# Altium schematic sheet schematic.SchDoc
size A; SheetNumber: 1; SheetTotal: 1
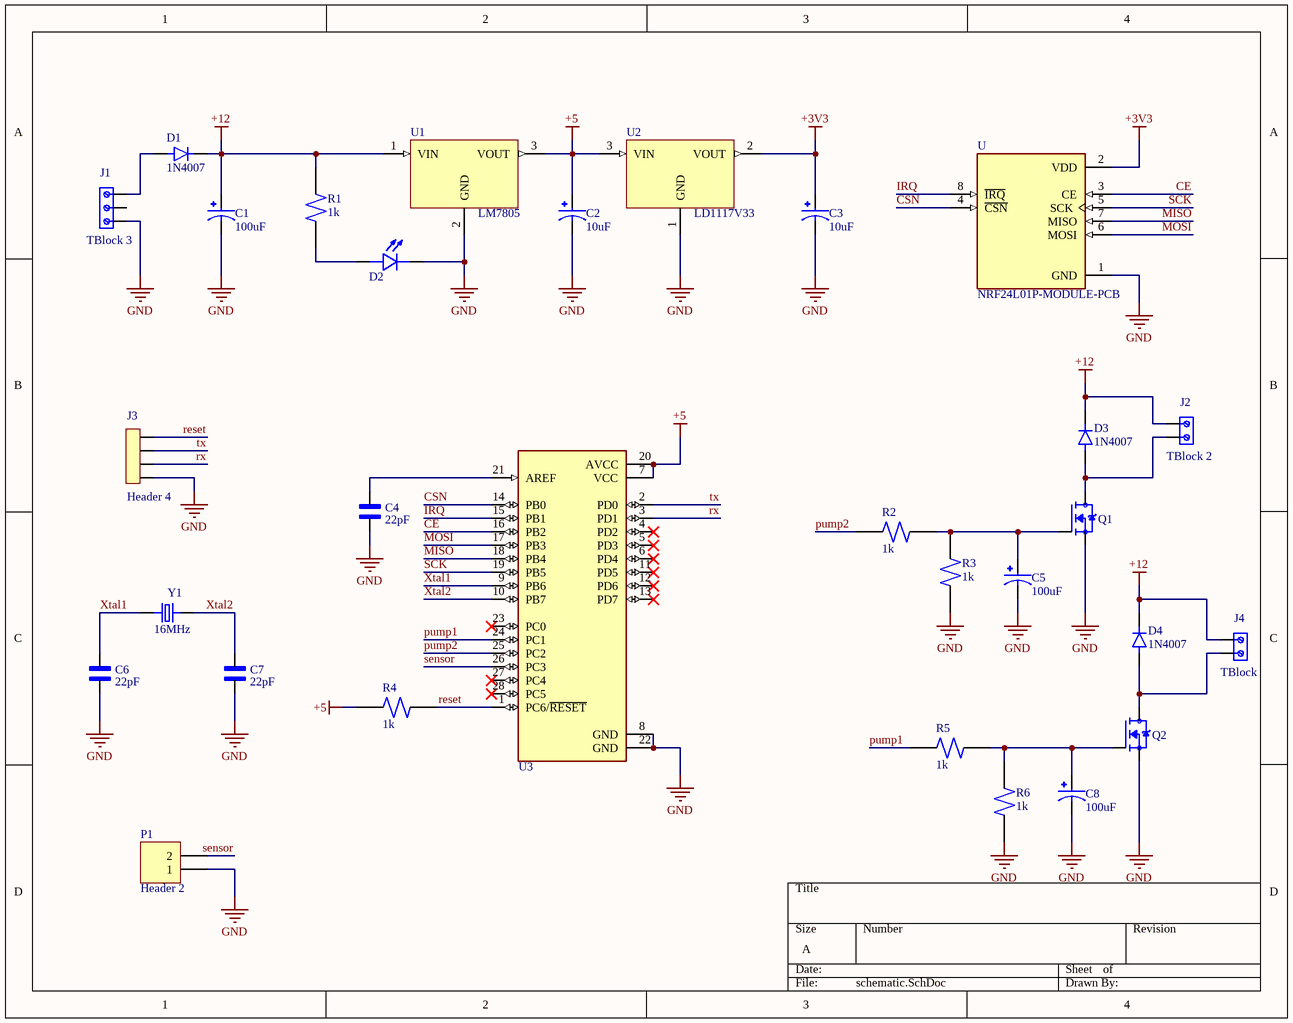
[diagram p0: schematic.SchDoc]

## Parts
C1  100uF  [CAPPRD500W50D500H1100]
C2  10uF  [CAPPRD500W50D500H1100]
C3  10uF  [CAPPRD500W50D500H1100]
C4  22pF  [CAPRB500W50L450T300H550]
C5  100uF  [CAPPRD500W50D500H1100]
C6  22pF  [CAPRB500W50L450T300H550]
C7  22pF  [CAPRB500W50L450T300H550]
C8  100uF  [CAPPRD500W50D500H1100]
D1  1N4007  [DIOAD1060W80L520D270]
D2  L08R5000Q1  [LEDRD254W57D500H1070]  (value not drawn)
D3  1N4007  [DIOAD1060W80L520D270]
D4  1N4007  [DIOAD1060W80L520D270]
J1  TBlock 3  [691214110003]
J2  TBlock 2  [691111710002]
J3  Header 4  [SULLINS_PPTC041LFBN-RC]
J4  TBlock  [691111710002]
P1  Header 2  [HDR1X2]
Q1  N-Channel mosfet  [TO254P1052X465X1989-3]  (value not drawn)
Q2  N-Channel mosfet  [TO254P1052X465X1989-3]  (value not drawn)
R1  1k  [RESAD1100W55L680D260]
R2  1k  [RESAD1100W55L680D260]
R3  1k  [RESAD1100W55L680D260]
R4  1k  [RESAD1100W55L680D260]
R5  1k  [RESAD1100W55L680D260]
R6  1k  [RESAD1100W55L680D260]
U  NRF24L01P-MODULE-PCB  [XCVR_NRF24L01P-MODULE-PCB]
U1  LM7805  [TO255P1020X450X1968-3]
U2  LD1117V33  [TO255P1020X450X1968-3]
U3  ATMEGA328P-PU  [DIP794W46P254L2967H457Q28B]  (value not drawn)
Y1  16MHz  [XTAL_ECS-160-20-4X]

## Nets
+3V3: C3.P U.2(VDD) U2.2(VOUT)
+5: C2.P R4.2 U1.3(VOUT) U2.3(VIN) U3.7(VCC) U3.20(AVCC)
+12: C1.P D1.C D3.C D4.C J2.1 J4.1 R1.2 U1.1(VIN)
GND: C1.N C2.N C3.N C4.1 C5.N C6.1 C7.1 C8.N D2.C J1.1 J3.4 P1.1 Q1.3(S) Q2.3(S) R3.2 R6.2 U.1(GND) U1.2(GND) U2.1(GND) U3.8(GND) U3.22(GND)
CE: U.3(CE) U3.16(PB2)
CSN: U.4(~{CSN}) U3.14(PB0)
IRQ: U.8(~{IRQ}) U3.15(PB1)
MISO: U.7(MISO) U3.18(PB4)
MOSI: U.6(MOSI) U3.17(PB3)
pump1: R5.1 U3.24(PC1)
pump2: R2.1 U3.25(PC2)
reset: J3.1 R4.1 U3.1(PC6/~{RESET})
rx: J3.3 U3.3(PD1)
SCK: U.5(SCK) U3.19(PB5)
sensor: P1.2 U3.26(PC3)
tx: J3.2 U3.2(PD0)
Xtal1: C6.2 U3.9(PB6) Y1.1
Xtal2: C7.2 U3.10(PB7) Y1.2
NetC4_2: C4.2 U3.21(AREF)
NetC5_P: C5.P Q1.1(G) R2.2 R3.1
NetC8_P: C8.P Q2.1(G) R5.2 R6.1
NetD1_A: D1.A J1.3
NetD2_A: D2.A R1.1
NetD3_A: D3.A J2.2 Q1.2(D)
NetD4_A: D4.A J4.2 Q2.2(D)

Not connected (* = marked no-connect by the designer): J1 2; U3 4(PD2)* 5(PD3)* 6(PD4)* 11(PD5)* 12(PD6)* 13(PD7)* 23(PC0)* 27(PC4)* 28(PC5)*

## Library data of the parts
C1-C3 C5 C8 = Electrolytic capacitor: FS-A; MF: {'manufacturer': u'Panasonic'}; MP: EEUFS0J221B; Package: None; Value: *; Availability: Unavailable; Price: None
C4 C6 C7 = Ceramic capacitor: 2200 pF Â±10% 250V Ceramic Capacitor X7R Radial; MF: TDK; MP: FG24X7R2E222KNT06; Digi-Key_Part_Number: 445-173386-1-ND; Purchase-URL: https://pricing.snapeda.com/search/part/FG24X7R2E222KNT06/?ref=eda; Check_prices: https://www.snapeda.com/parts/FG24X7R2E222KNT06/TDK/view-part/?ref=eda; Value: *; Package: Radial TDK; SnapEDA_Link: https://www.snapeda.com/parts/FG24X7R2E222KNT06/TDK/view-part/?ref=snap
D1 D3 D4 = 1N4007: Diode Switching 1KV 1A 2-Pin DO-41; Price: None; MP: 1N4007; Value: *; Availability: Unavailable; Package: None
D2 = LED: LED, Orange, Through Hole, T-1 3/4 (5mm), 30 mA, 2.1 V, 635 nm; MF: {'manufacturer': u'LED Technology'}; Price: None; Package: None; Availability: Unavailable; MP: L08R5000Q1; Value: *
J1 = Terminal blocks - 3Pins (Small): 3 Position Wire to Board Terminal Block Horizontal with Board 0.138 (3.50mm) Through Hole; MF: Wurth Elektronik; Price: None; SnapEDA_Link: https://www.snapeda.com/parts/691214110003/Wurth+Elektronik/view-part/?ref=snap; Purchase-URL: https://pricing.snapeda.com/search/part/691214110003/?ref=eda; Availability: In Stock; MP: 691214110003; Package: None; Check_prices: https://www.snapeda.com/parts/691214110003/Wurth+Elektronik/view-part/?ref=eda; Value: *
J2 J4 = Terminal Block - 2Pins: 2 Position Wire to Board Terminal Block Horizontal with Board 0.197 _5.00mm_ Through Hole; MF: Wurth Electronics; Value: *; Availability: Unavailable; MP: 691111710002; Price: None; Package: None; SnapEDA_Link: https://www.snapeda.com/parts/691111710002/Wurth%20Electronics%20Inc./view-part/1195092/?ref=snap
J3 = Female header - 4Pins: 4 Position Header Connector Through Hole; MP: PPTC041LFBN-RC; MF: Sullins Connector; Value: *; SnapEDA_Link: https://www.snapeda.com/parts/PPTC041LFBN-RC/Sullins%20Connector%20Solutions/view-part/285917/?ref=snap; Package: None; Availability: Warning; Check_prices: https://www.snapeda.com/parts/PPTC041LFBN-RC/Sullins%20Connector%20Solutions/view-part/285917/?ref=eda; Price: None; Purchase-URL: https://pricing.snapeda.com/search/part/PPTC041LFBN-RC/?ref=eda
P1 = Header 2: Header, 2-Pin; LatestRevisionDate: 17-Jul-2002; LatestRevisionNote: Re-released for DXP Platform.; Publisher: Altium Limited
Q1 Q2 = IRF540: N-Channel 100V 22A (Tc) 85W (Tc) Through Hole TO-220AB; Value: *; MP: IRF540; Package: None; Availability: Unavailable; Price: None
R1-R6 = Resistor (0.25W): (MFR-25FBF52-10K) 10,2 kOhm bei 1% 0,25W, 1/4W Durchbohrlochwiderstand Axial Metal Film; MF: Yageo; Digi-Key_Part_Number: 10.2KXBK-ND; SnapEDA_Link: https://www.snapeda.com/parts/MFR-25FBF52-10K/Yageo/view-part/424333/?ref=snap; Package: Axial Yageo; Purchase-URL: https://pricing.snapeda.com/search/part/MFR-25FBF52-10K/?ref=eda; MP: MFR-25FBF52-10K; Value: *
U = NRF24L01P-MODULE-PCB: - Transceiver For Use With nRF24L01+; MF: Nordic Semiconductor; Package: None; MP: NRF24L01P-MODULE-PCB; Value: *; Availability: Bad; Price: None; SnapEDA_Link: https://www.snapeda.com/parts/NRF24L01P-MODULE-PCB/Nordic%20Semiconductor%20ASA/view-part/230534/?ref=snap; Mouser-Purchase-URL: https://snapeda.com/shop?store=Mouser&id=230534
U1 = LM78__: MP: LM7805CT/NOPB; Price: None; Value: *; Availability: Unavailable; Package: None
U3 = ATMEGA328P-PU: ATmega Series 20 MHz 32 KB Flash 2 KB SRAM 8-Bit Microcontroller - DIP-28; Value: *; MP: ATMEGA328P-PU; Package: None; Availability: Unavailable; Price: None
Y1 = Crystal oscilator: CRYSTAL T/H; MF: {'manufacturer': u'ECS Inc.'}; MP: ECS-160-S-4; Package: None; Value: *; Availability: Unavailable; Price: None
U2 = LD1117V33: Package: None; MP: LD1117V33; Price: None; Availability: Unavailable; Value: *